# EAGLE design Side_Short (EAGLE 9.4.2)
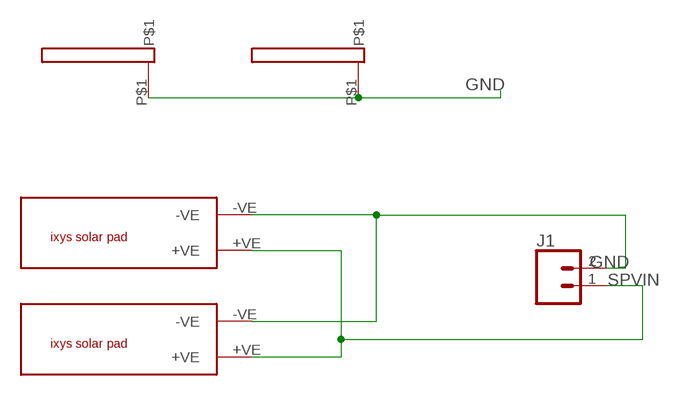
[diagram p0: schematic, sheet 1]

## Parts
J1  CONN_02  [1X02]
U$1  IXYS  [IXYS]
U$2  IXYS  [IXYS]
U$3  16X2  [16X2]
U$4  16X2  [16X2]

## Nets
GND: J1.2 U$1.-VE U$2.-VE U$3.P$1 U$4.P$1
SPVIN: J1.1 U$1.+VE U$2.+VE

## Library data of the parts
J1 = SparkFun-Connectors:CONN_02: Multi connection point. Often used as Generic Header-pin footprint for 0.1 inch spaced/style header connections On any of the 0.1 inch spaced packages, you can populate with these: Break Away Headers - Straight <https://www.sparkfun.com/products/116> (PRT-00116) Break Away Male Headers - Right Angle <https://www.sparkfun.com/products/553> (PRT-00553) Female Headers <https://www.sparkfun.com/products/115> (PRT-00115) Break Away Headers - Machine Pin <https://www.sparkfun.com/products/117> (PRT-00117) Break Away Female Headers - Swiss Machine Pin <https://www.sparkfun.com/products/743> (PRT-00743) For SCREWTERMINALS and SPRING TERMINALS visit here: Screw Terimnals on SparkFun.com <https://www.sparkfun.com/search/results?term=Screw+Terminals> (5mm/3.5mm/2.54mm spacing) This device is also useful as a general connection point to wire up your design to another part of your project. Our various solder wires solder well into these plated through hole pads. Hook-Up Wire - Assortment (Stranded, 22 AWG) <https://www.sparkfun.com/products/11375> (PRT-11375) Hook-Up Wire - Assortment (Solid Core, 22 AWG) <https://www.sparkfun.com/products/11367> (PRT-11367) View the entire wire category on our website here <https://www.sparkfun.com/categories/141> Special notes: Molex polarized connector foot print use with: PRT-08233 with associated crimp pins and housings. 2.54_SCREWTERM for use with PRT-10571. 3.5mm Screw Terminal footprints for PRT-08084 5mm Screw Terminal footprints for use with PRT-08432
U$1 U$2 = ixys:IXYS
U$3 U$4 = 16x2PAD:16X2: Pad for 90 degree solder

## Net classes
1 vcc: width 0.254 mm

## Board
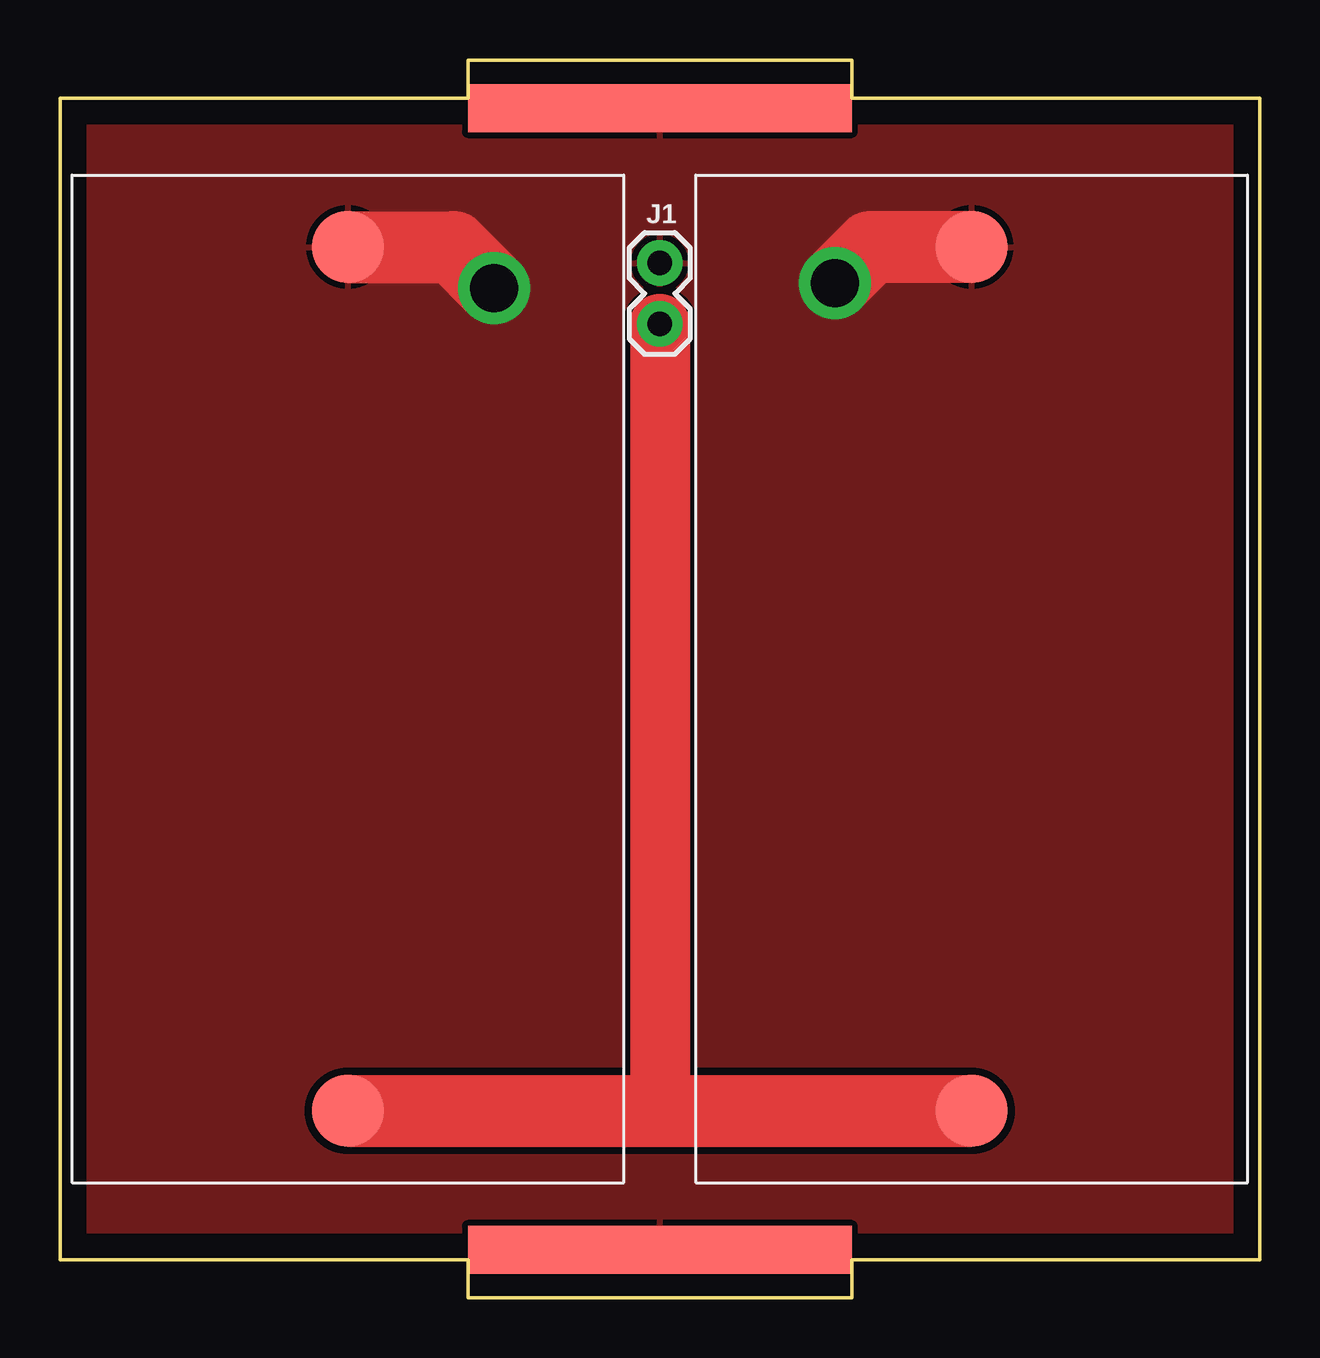
[diagram p1: board, top side]
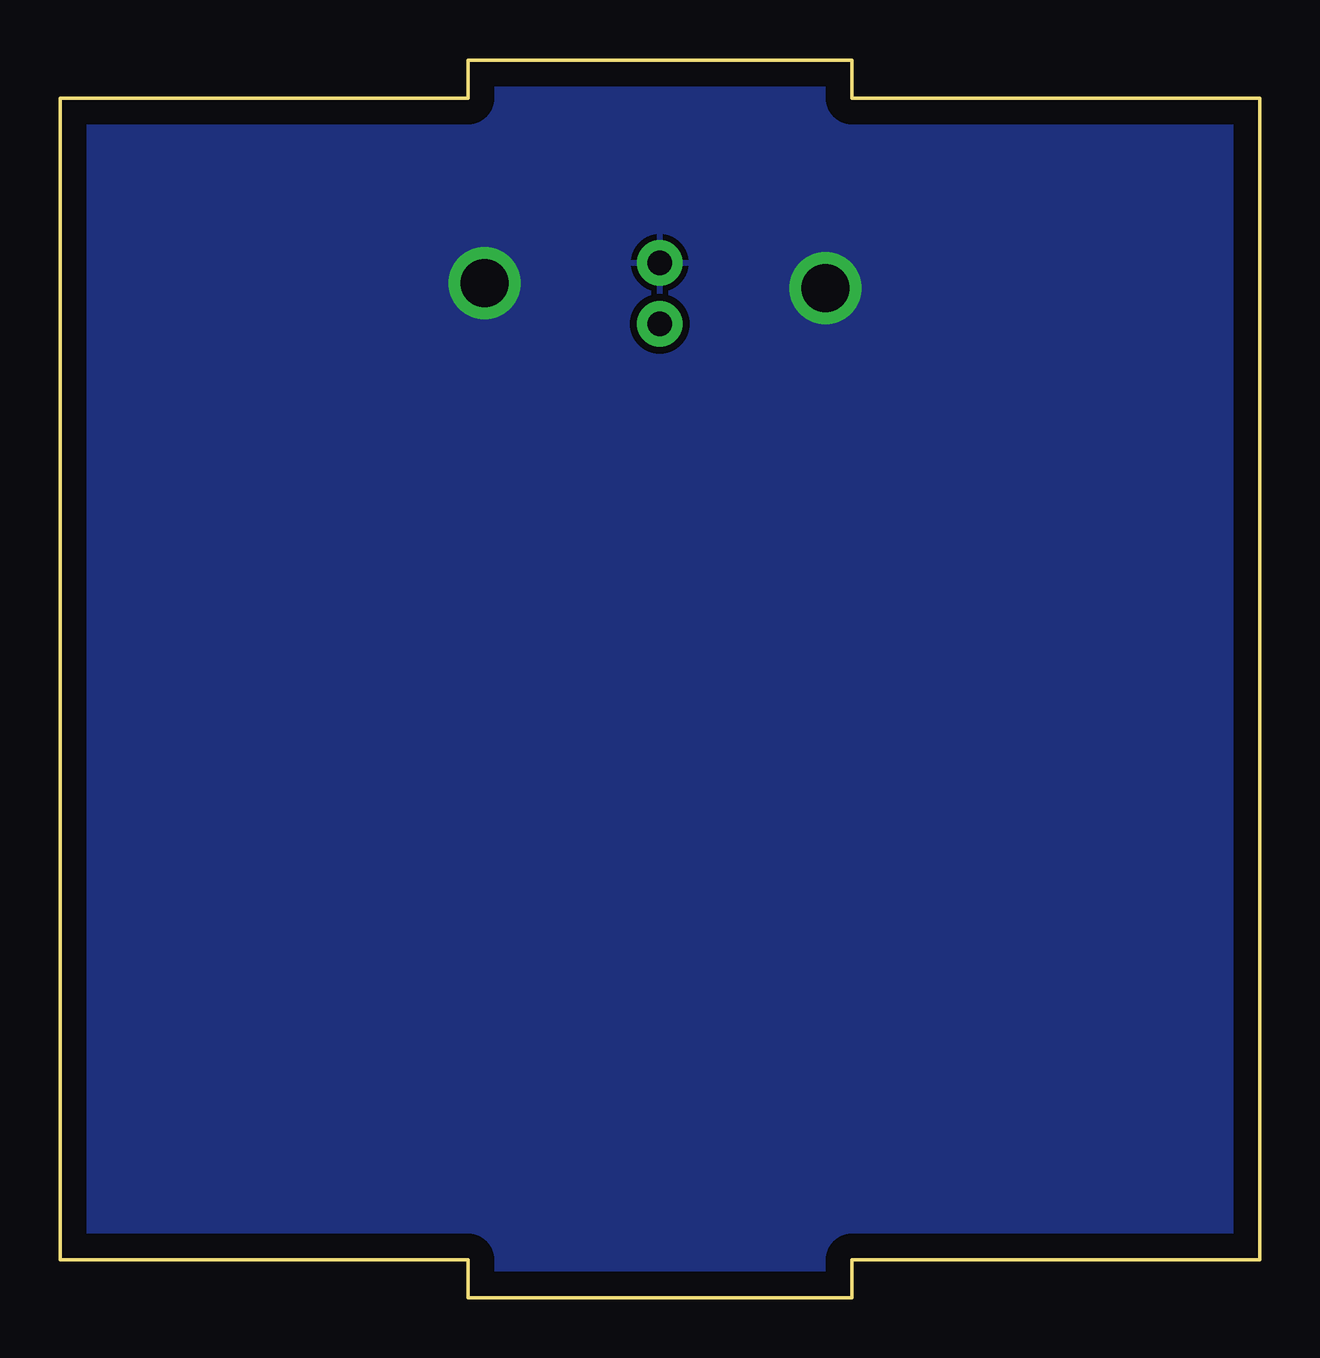
[diagram p2: board, bottom side, seen from below]

Size 50 x 51.6 mm. Coordinates in mm from the lower left corner, seen from the top.
Outline: 0,1.6 17,1.6 17,0 33,0 33,1.6 50,1.6 50,50 33,50 33,51.6 17,51.6 17,50 0,50 0,1.6
Copper layers (1*16): Top 0.035mm / dielectric 1.5mm / Bottom 0.035mm
Design rules "default *": minimum track width 6mil, minimum drill 0.35mm, track to track 12mil, track to pad 6mil, pad to pad 6mil, via to via 6mil, smd to smd 6mil, copper to edge 40mil, drill to drill 6mil, minimum pad ring 10mil, minimum via ring 8mil, stop-mask expansion 4mil, vias tented up to drill 0mil, thermal gap 10mil

### Footprints (pad centres in the part's own frame; a part is rotated, then mirrored left to right if it is on the bottom)
1X02 = drill 1.016 pad 1.88: 1 0,0; 2 2.54,0
IXYS = smd 3 x 3: +VE 3,11.5; -VE 39,11.5
16X2 = smd 16 x 2: P$1 0,0

### Placement (x,y rotation side)
J1  25,40.6 90 top
U$1  23.5,4.8 90 top
U$2  49.5,4.8 90 top
U$3  25,49.6 0 top
U$4  25,2 0 top

### Tracks (layer width: path | path; a pad name or v marks a point on that pad's centre or on a via)
GND  (via drill 2)
  Top 3: U$1.-VE 16.4,43.8 v18.1,42.1 | U$2.-VE 33.8,43.8 v32.3,42.3
  pour Top: -6.2,48.4 -0.6,54 3,54 49.7,54 53,50.7 54.7,49 54.7,2.4 50.4,-1.9 -1.6,-1.9 -6.2,2.7
  pour Bottom: -6.3,48.3 -0.6,54 49.7,54 54.7,49 54.7,48.5 54.7,2.5 50.2,-2 -1.3,-2 -6.2,2.9 -6.2,48.2
SPVIN
  Top 2.5: J1.1 25,8 24.8,7.8
  Top 3: U$1.+VE 24.8,7.8 U$2.+VE